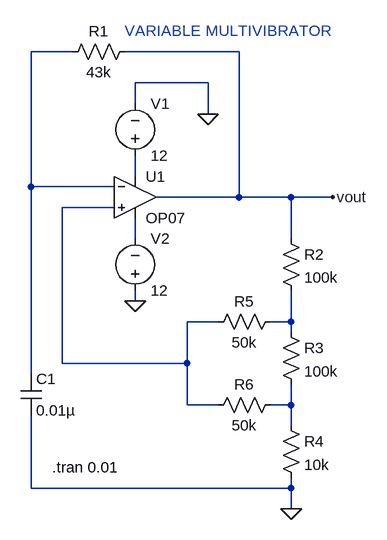
[diagram p0: schematic Variable Multivibrator.asc]
Variable Multivibrator.asc, the LTspice schematic file:
Version 4
SHEET 1 880 728
WIRE 80 -80 16 -80
WIRE 336 -80 160 -80
WIRE 288 -32 176 -32
WIRE 176 0 176 -32
WIRE 288 16 288 -32
WIRE 176 112 176 80
WIRE 16 128 16 -80
WIRE 144 128 16 128
WIRE 336 144 336 -80
WIRE 336 144 208 144
WIRE 416 144 336 144
WIRE 480 144 416 144
WIRE 144 160 64 160
WIRE 176 208 176 176
WIRE 416 208 416 144
WIRE 176 304 176 288
WIRE 304 336 256 336
WIRE 416 336 416 288
WIRE 416 336 384 336
WIRE 416 352 416 336
WIRE 64 400 64 160
WIRE 256 400 256 336
WIRE 256 400 64 400
WIRE 16 416 16 128
WIRE 256 464 256 400
WIRE 304 464 256 464
WIRE 416 464 416 432
WIRE 416 464 384 464
WIRE 416 496 416 464
WIRE 16 592 16 480
WIRE 416 592 416 576
WIRE 416 592 16 592
WIRE 416 624 416 592
FLAG 176 304 0
FLAG 288 16 0
FLAG 416 624 0
FLAG 480 144 vout
SYMBOL OpAmps\\OP07 176 80 R0
SYMATTR InstName U1
SYMBOL voltage 176 96 M180
WINDOW 0 24 96 Left 2
WINDOW 3 24 16 Left 2
WINDOW 123 0 0 Left 0
WINDOW 39 0 0 Left 0
SYMATTR InstName V1
SYMATTR Value 12
SYMBOL voltage 176 304 M180
WINDOW 0 24 96 Left 2
WINDOW 3 24 16 Left 2
WINDOW 123 0 0 Left 0
WINDOW 39 0 0 Left 0
SYMATTR InstName V2
SYMATTR Value 12
SYMBOL res 176 -96 R90
WINDOW 0 0 56 VBottom 2
WINDOW 3 32 56 VTop 2
SYMATTR InstName R1
SYMATTR Value 43k
SYMBOL cap 0 416 R0
SYMATTR InstName C1
SYMATTR Value 0.01µ
SYMBOL res 400 192 R0
SYMATTR InstName R2
SYMATTR Value 100k
SYMBOL res 400 336 R0
SYMATTR InstName R3
SYMATTR Value 100k
SYMBOL res 400 480 R0
SYMATTR InstName R4
SYMATTR Value 10k
SYMBOL res 400 448 R90
WINDOW 0 0 56 VBottom 2
WINDOW 3 32 56 VTop 2
SYMATTR InstName R6
SYMATTR Value 50k
SYMBOL res 400 320 R90
WINDOW 0 0 56 VBottom 2
WINDOW 3 32 56 VTop 2
SYMATTR InstName R5
SYMATTR Value 50k
TEXT 48 560 Left 2 !.tran 0.01
TEXT 160 -112 Left 2 ;VARIABLE MULTIVIBRATOR

The netlist it stands for:
* Variable Multivibrator.asc
XU1 N003 N001 N002 N004 vout LT1001  ; OP07, pins In+ In- V+ V- OUT
V1 N002 0 12
V2 0 N004 12
R1 vout N001 43k
C1 N001 0 0.01µ
R2 vout N005 100k
R3 N005 N006 100k
R4 N006 0 10k
R6 N006 N003 50k
R5 N005 N003 50k
.tran 0.01
* VARIABLE MULTIVIBRATOR
.lib LTC.lib
.backanno
.end